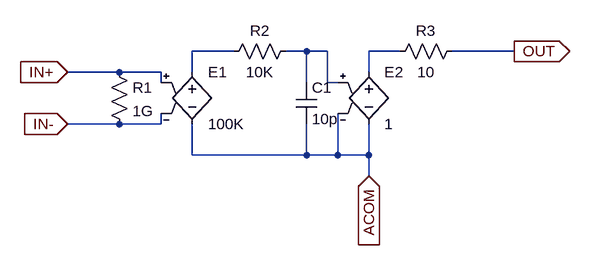
[diagram p0: schematic op_amp4.asc]
op_amp4.asc, the LTspice schematic file:
Version 4
SHEET 1 880 680
WIRE 112 160 48 160
WIRE 224 160 192 160
WIRE 256 160 224 160
WIRE 368 160 320 160
WIRE 544 160 448 160
WIRE -64 192 -144 192
WIRE 0 192 -64 192
WIRE 48 192 48 160
WIRE 320 192 320 160
WIRE 0 208 0 192
WIRE 224 208 224 160
WIRE 256 208 256 160
WIRE 272 208 256 208
WIRE -64 272 -144 272
WIRE 0 272 0 256
WIRE 0 272 -64 272
WIRE 48 320 48 272
WIRE 224 320 224 272
WIRE 224 320 48 320
WIRE 272 320 272 256
WIRE 272 320 224 320
WIRE 320 320 320 272
WIRE 320 320 272 320
WIRE 320 352 320 320
FLAG 544 160 OUT
IOPIN 544 160 Out
FLAG -144 192 IN+
IOPIN -144 192 In
FLAG -144 272 IN-
IOPIN -144 272 In
FLAG 320 352 ACOM
IOPIN 320 352 In
SYMBOL e 48 176 R0
SYMATTR InstName E1
SYMATTR Value 100K
SYMBOL e 320 176 R0
SYMATTR InstName E2
SYMATTR Value 1
SYMBOL res -80 176 R0
SYMATTR InstName R1
SYMATTR Value 1G
SYMBOL res 208 144 R90
WINDOW 0 0 56 VBottom 0
WINDOW 3 32 56 VTop 0
SYMATTR InstName R2
SYMATTR Value 10K
SYMBOL cap 208 208 R0
SYMATTR InstName C1
SYMATTR Value 10p
SYMBOL res 464 144 R90
WINDOW 0 0 56 VBottom 0
WINDOW 3 32 56 VTop 0
SYMATTR InstName R3
SYMATTR Value 10

The netlist it stands for:
* op_amp4.asc
E1 N001 ACOM IN+ IN- 100K
E2 N003 ACOM N002 ACOM 1
R1 IN+ IN- 1G
R2 N002 N001 10K
C1 N002 ACOM 10p
R3 OUT N003 10
.backanno
.end